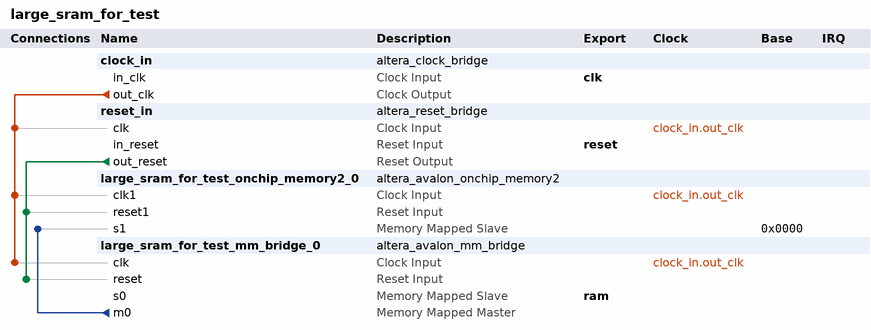
[diagram p0: system contents]
# Platform Designer (Qsys) system large_sram_for_test, Arria 10 10AX115N3F40E2SG
# Parameters at their usual value, and those the tool derives, are not listed.
package require -exact qsys 1.0
create_system large_sram_for_test
set_project_property DEVICE_FAMILY {Arria 10}
set_project_property DEVICE 10AX115N3F40E2SG

add_component clock_in ip/large_sram_for_test/large_sram_for_test_clock_in.ip altera_clock_bridge clock_in 17.0
load_component clock_in
set_component_parameter_value DERIVED_CLOCK_RATE 0
set_component_parameter_value EXPLICIT_CLOCK_RATE 50000000
save_component

add_component reset_in ip/large_sram_for_test/large_sram_for_test_reset_in.ip altera_reset_bridge reset_in 17.0
load_component reset_in
set_component_parameter_value ACTIVE_LOW_RESET 0
set_component_parameter_value SYNCHRONOUS_EDGES deassert
save_component

add_component large_sram_for_test_onchip_memory2_0 ip/large_sram_for_test/large_sram_for_test_onchip_memory2_0.ip altera_avalon_onchip_memory2 large_sram_for_test_onchip_memory2_0 17.0
load_component large_sram_for_test_onchip_memory2_0
set_component_parameter_value dataWidth 512
set_component_parameter_value dualPort false
set_component_parameter_value initMemContent true
set_component_parameter_value initializationFileName onchip_mem.hex
set_component_parameter_value memorySize 524288
save_component

add_component large_sram_for_test_mm_bridge_0 ip/large_sram_for_test/large_sram_for_test_mm_bridge_0.ip altera_avalon_mm_bridge large_sram_for_test_mm_bridge_0 17.0
load_component large_sram_for_test_mm_bridge_0
set_component_parameter_value DATA_WIDTH 512
set_component_parameter_value ADDRESS_WIDTH 19
set_component_parameter_value USE_AUTO_ADDRESS_WIDTH 0
set_component_parameter_value ADDRESS_UNITS SYMBOLS
set_component_parameter_value MAX_BURST_SIZE 64
set_component_parameter_value MAX_PENDING_RESPONSES 4
save_component

# connections
add_connection clock_in.out_clk large_sram_for_test_mm_bridge_0.clk clock
add_connection clock_in.out_clk large_sram_for_test_onchip_memory2_0.clk1 clock
add_connection clock_in.out_clk reset_in.clk clock
add_connection reset_in.out_reset large_sram_for_test_mm_bridge_0.reset reset
add_connection reset_in.out_reset large_sram_for_test_onchip_memory2_0.reset1 reset
add_connection large_sram_for_test_mm_bridge_0.m0 large_sram_for_test_onchip_memory2_0.s1 avalon
set_connection_parameter_value large_sram_for_test_mm_bridge_0.m0/large_sram_for_test_onchip_memory2_0.s1 baseAddress 0x0000

# exported interfaces
add_interface clk clock sink
set_interface_property clk EXPORT_OF clock_in.in_clk
add_interface ram avalon slave
set_interface_property ram EXPORT_OF large_sram_for_test_mm_bridge_0.s0
add_interface reset reset sink
set_interface_property reset EXPORT_OF reset_in.in_reset

set_interconnect_requirement {$system} qsys_mm.clockCrossingAdapter HANDSHAKE
set_interconnect_requirement {$system} qsys_mm.enableEccProtection FALSE
set_interconnect_requirement {$system} qsys_mm.insertDefaultSlave FALSE
set_interconnect_requirement {$system} qsys_mm.maxAdditionalLatency 1

save_system large_sram_for_test.qsys
